# Altium schematic sheet PowerSupply.SchDoc
size A4; SheetNumber: 2; SheetTotal: 4
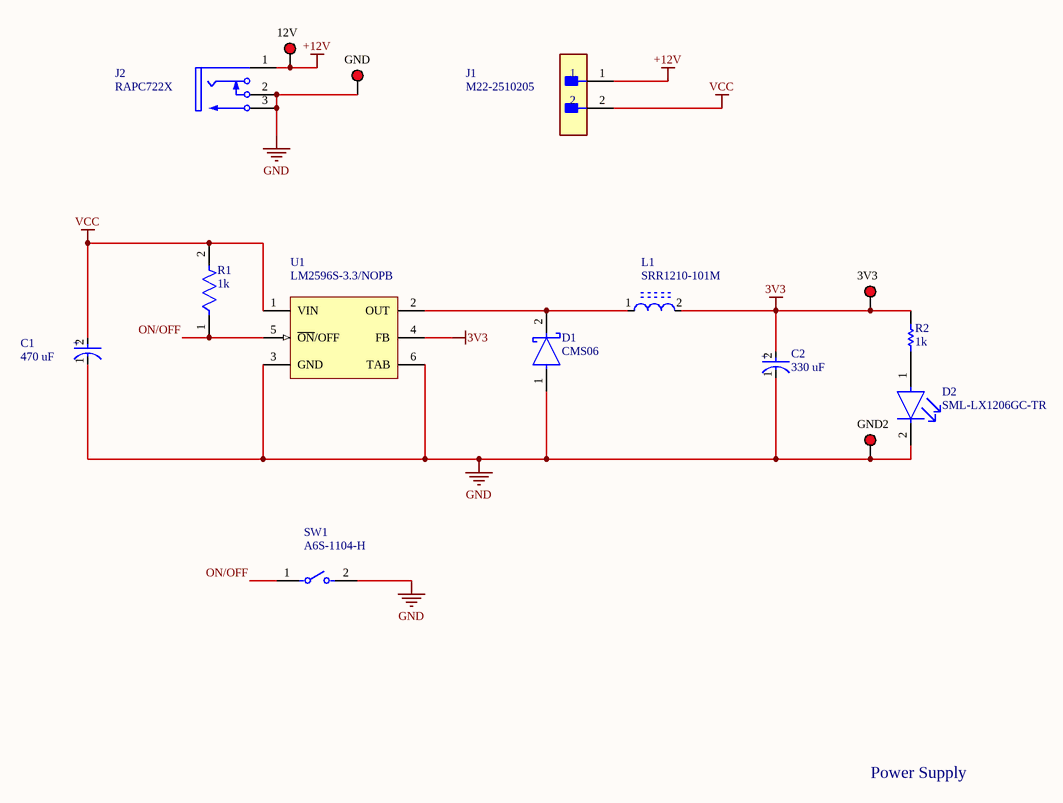
[diagram p0: PowerSupply.SchDoc]

## Parts
3V3  5010  [KSTN-5010_V]  (value not drawn)
12V  5010  [KSTN-5010_V]  (value not drawn)
C1  470 uF  [FP-FKF-MFG]
C2  330 uF  [FP-FKG-MFG]
D1  CMS06  [FP-M-FLAT-MFG]
D2  SML-LX1206GC-TR  [FP-SML-LX1206GC-TR-MFG]
GND  5010  [KSTN-5010_V]  (value not drawn)
GND2  5010  [KSTN-5010_V]  (value not drawn)
J1  M22-2510205  [FP-M22-2510205-MFG]
J2  RAPC722X  [SWITCH-RAPC712X-3_V]
L1  SRR1210-101M  [FP-SRR1210-MFG]
R1  1k  [FP-CRCW1206-e3-MFG]
R2  1k  [RESC3216X70X50ML20T25]
SW1  A6S-1104-H  [FP-A6S-1104-H-MFG]
U1  LM2596S-3.3/NOPB  [KTT0005B_M]

## Nets
3V3: 3V3.1 C2.2(A) L1.2 R2.2 U1.4(FB)
+12V: 12V.1 J1.1 J2.1
GND: C1.1(C) C2.1(C) D1.1(A) D2.2(C) GND.1 GND2.1 J2.2 J2.3 SW1.2 U1.3(GND) U1.6(TAB)
VCC: C1.2(A) J1.2 R1.2 U1.1(VIN)
ON/OFF: R1.1 SW1.1 U1.5(~{ON}/OFF)
NetD1_2: D1.2(C) L1.1 U1.2(OUT)
NetD2_1: D2.1(A) R2.1

## Notes on the sheet
- Power Supply
- (in symbol CMP-2000-06208-3) +
- (in symbol CMP-05427-002115-1) +

## Library data of the parts
3V3 12V GND GND2 = CMP-1672-00002-4: Test Point, Red, Through Hole, RoHS, Bulk; Manufacturer: Keystone; Contact Material: Bronze; Mounting Technology: Through Hole; RoHSCompliant: true; Pins: 1; Package Quantity: 100; ComponentLink2Description: Datasheet; Height: 8.12 mm; ComponentLink1URL: http://www.keyelco.com/; DatasheetVersion: Rev. F, 12/2013; Mount: Through Hole; PackageReference: 5010; Contact Plating: Silver; Packaging: Bulk; Colour: Red; REACH SVHC: No SVHC; PackageDescription: 1-Pin Through Hole Device, Dia 3.17 mm; ComponentLink2URL: http://www.keyelco.com/product-pdf.cfm?p=1319; ComponentLink1Description: Manufacturer URL
C1 = CMP-2000-06208-3: CAP ALUM 100UF 20% 50V SMD; Leakage Current: 3uA; ESR (Equivalent Series Resistance): 340mR; Material: Aluminium; Ripple Current: 350mA; Life (Hours): 2000Hour; Min Operating Temperature: -55°C; Contact Plating: Tin; REACH SVHC: No SVHC; RoHS Compliant: Yes; Width: 10mm; Radiation Hardening: No; Termination: SMD/SMT; Packaging: Tape and Reel; Max Operating Temperature: 105°C; Case/Package: Radial; Voltage Rating: 50V; Length: 10.2mm; Voltage: 50V; Package Quantity: 1; Voltage Rating (DC): 50V; Height - Seated (Max): 0.402inch; Mount: Surface Mount; Impedance: 340mR; Construction: Cylindrical; Height: 10.2mm; Lead Free: Lead Free; Dielectric Material: Aluminium; Series: FK; Tolerance: 20%; Diameter: 8mm; Ripple Current (AC): 350mA; Capacitance: 100uF; Number of Pins: 2
C2 = CMP-05427-002115-1: CAP ALUM 330UF 20% 35V SMD; ESR (Equivalent Series Resistance): 80mR; Ripple Current: 850mA; Dielectric Material: Aluminium; Lead Length: 3.5mm; Life (Hours): 2000Hour; Leakage Current: 115.5uA; Length: 10.2mm; Construction: Cylindrical; Package Quantity: 500; Termination: SMD/SMT; RoHS Compliant: Yes; Impedance: 80mR; Width: 10.3mm; Height - Seated (Max): 0.402inch; Voltage: 35V; Voltage Rating: 35V; Diameter: 10mm; Contact Plating: Tin; Number of Pins: 2; Capacitance: 330uF; Case/Package: Radial; Reach SVHC Compliant: Yes; Lead Free: Lead Free; Series: FK; Ripple Current (AC): 850mA; Tolerance: 20%; Ratings: AEC-Q200; Lead Pitch: 4.6mm; Mount: Surface Mount; Height: 10.2mm; Max Operating Temperature: 105°C; Packaging: Tape and Reel; Min Operating Temperature: -55°C; Voltage Rating (DC): 35V; Radiation Hardening: No
D1 = CMP-2000-06115-2: DIODE SCHOTTKY 30V 2A MFLAT; Forward Voltage: 370mV; Peak Non-Repetitive Surge Current: 40A; Max Reverse Leakage Current: 3mA; Element Configuration: Single; Package Quantity: 1; Max Operating Temperature: 125°C; Mount: Surface Mount; Max Repetitive Reverse Voltage (Vrrm): 30V; Forward Current: 2A; Number of Pins: 2; Min Operating Temperature: -40°C; Radiation Hardening: No; Average Rectified Current: 2A; Contact Plating: Tin; Max Reverse Voltage (DC): 30V; Peak Reverse Current: 3mA; Max Surge Current: 40A; Packaging: Tape and Reel
D2 = CMP-2000-07122-2: LED GREEN CLEAR 1206 SMD; Test Current: 20mA; Luminous Intensity: 10mcd; Forward Voltage: 2.2V; Viewing Angle: 160°; Lens Color: Colorless; Approvals: UL; Dominant Wavelength: 565nm; Current Rating: 25mA; Number of LEDs: 1; Power Rating: 65mW; Lens Style: Rectangular; Length: 3.2mm; Mount: Surface Mount; Package Quantity: 1; Forward Current: 20mA; Case/Package: 1206; Lead Free: Lead Free; Case Code (Imperial): 1206; Max Operating Temperature: 85°C; REACH SVHC: No SVHC; RoHS Compliant: Yes; Number of Pins: 2; Illumination Color: Green; Width: 1.6mm; Packaging: Tape and Reel; Wavelength: 565nm; Lens Transparency: Clear; Height: 1.1mm; Color: Green; Min Operating Temperature: -40°C; Case Code (Metric): 3216
J1 = CMP-15831-000005-1: CONN HEADER VERT 2POS 2MM; Manufacturer: Harwin; Conn Gender: Male; Current Rating: 2A; Number Of Contacts: 2; Conn Orientation: Vertical; Temperature Range Low: -40°C; Device Class L1: Connectors; ComponentLink2URL: https://cdn.harwin.com/pdfs/C018XX_M22_Series_Connectors.pdf; Temperature Range High: +105°C; Pitch: 2mm; Number Of Rows: 1; Temperature: -40°C to +105°C; Automotive: No; Device Class L3: unset; Octopart: https://octopart.com/m22-2510205-harwin-2538221; Mouser Description: Headers & Wire Housings 2 PIN SIL VERTICAL GOLD PIN HEADER; Height: 5.45mm; Category: Conn; Digikey Description: CONN HEADER VERT 2POS 2MM; Contact Material: Gold,Nickel; Lead Free: Yes; ComponentLink2Description: Datasheet; Manufacturer Part Number: M22-2510205; Device Class L2: Headers and Wire Housings; Package: 0; Footprint Url: https://cdn.harwin.com/pdfs/M22-251.pdf; RoHS: TRUE
J2 = CMP-2000-05384-1: Power Jack, 5 A, 3-Pin THD, RoHS, Bulk; Manufacturer: Switchcraft; Current Rating: 5A; Plug/Mating Plug Diameter: 2.1mmID,5.5mmOD; Gender: Male; Mating Products: S765-ND / -CONNPLUGMINIPWR2CONDWHT/RED / S760K-ND / -CONNPOWERPLUGMINI.08"BLACK / SC1052-ND / -CONNPOWERPLUGMINIBLACK; Number of Positions/Contacts: 2Conductors,2Contacts; Internal Switch(s): SingleSwitch,NormallyClosed; Shielding: Unshielded; Catalog Drawings: RAPC7(1,2)2XSide / RAPC7(1,2)2XTop; Dynamic Catalog: SwitchcraftInc; Other Names: Q2287470A / RAPC722X-ND / SC1313; Standard Package: 2,500; Termination: SolderEyelet(s); Family: Barrel-PowerConnectors; Housing Color: Black; Housing Material: Thermoplastic; RoHS Information: SwitchcraftRoHSInfo; Color: Black; Contact Material - Plating: Nickel; Mounting Type: ThroughHole,RightAngle; Manufacturer URL: http://www.switchcraft.com/; Contact Material: Brass; Datasheet Version: Rev. A, 08/2005; Connector Type: Jack; Category: Connectors,Interconnects; Datasheet URL: http://www.mouser.com/ds/2/393/rapc722x_cd-371352.pdf
L1 = CMP-07248-000065-1: FIXED IND 100UH 2.5A 135MOHM SMD; Shielding: Shielded; DC Resistance (DCR): 135mR; Core Material: Ferrite; Inductance Tolerance: 20%; Saturation Current: 2.2A; Q Factor: 16; Self Resonant Frequency: 3MHz; Test Frequency: 100kHz; Height: 10mm; Width: 0.472inch; Mount: Surface Mount; Inductance: 100uH; RMS Current (Irms): 2.5A; Packaging: Tape and Reel; Max Operating Temperature: 125°C; Military Standard: Not; DC Current: 2.5A; Max DC Current: 2.5A; Length: 12mm; RoHS Compliant: Yes; Height - Seated (Max): 0.394inch; Resistor Type: Wirewound; Current Rating: 2.5A; REACH SVHC: No SVHC; Tolerance: 20%; Series: SRR1210; Package Quantity: 1; Min Operating Temperature: -40°C; Depth: 12.5mm; Case/Package: 1210; Termination: SMD/SMT
R1 = CMP-2003-01876-2: RES Thick Film, 1.2kΩ, 1%, 0.25W, 100ppm/°C, 1206; Voltage Rating (DC): 200V; Power Rating: 250mW; Resistance: 1.2kR; Temperature Coefficient: 100ppm/°C; Features: Automotive AEC-Q200; Lead Free: Lead Free; Termination: SMD/SMT; Composition: Thick Film; Length: 3.2mm; Width: 0.063inch; Case Code (Imperial): 1206; Contact Plating: Tin; Number of Terminations: 2; Height: 0.55mm; Depth: 1.6mm; Max Operating Temperature: 155°C; Tolerance: 1%; Case/Package: 1206; Voltage Rating: 200V; Case Code (Metric): 3216; Packaging: Tape and Reel; Weight: 0.000353oz; Package Quantity: 10; Max Power Dissipation: 250mW; Min Operating Temperature: -55°C; Working Voltage: 200V; Radiation Hardening: No; Military Standard: Not
R2 = CMP-2003-04435-1: Part Number: ERA8AEB202V; Manufacturer: Panasonic
SW1 = CMP-08827-000005-1: SWITCH SLIDE DIP SPST 25MA 24V; Manufacturer: Omron Electronics Inc-EMC Div; Throw Configuration: SPST-NO; Standoff Height: 0mm; Number Of Circuits: 1; Electromechanical Life: 1000Cycles; Contact Resistance: 200mΩ; Digikey Description: SWITCH SLIDE DIP SPST 25MA 24V; ComponentLink2Description: Datasheet; Mount: Surface Mount; Manufacturer Part Number: A6S-1104-H; ComponentLink2URL: https://omronfs.omron.com/en_US/ecb/products/pdf/en-a6s.pdf; Category: Switch; Height: 3.95mm; Device Class L3: DIP Switches; Octopart: https://octopart.com/a6s-1104-h-omron-55410938; Mouser Description: DIP Switches / SIP Switches Dip Switch; Lead Free: Yes; Temperature Range Low: -20°C; Temperature Range High: +70°C; Automotive: No; Ambient Temperature Range Low: -20°C; Ambient Temperature Range High: +70°C; Voltage Rating Dc: 24V; Device Class L2: Switches; RoHS: TRUE; Package: 0; Contact Current Rating: 25mA; Device Class L1: Electromechanical; Temperature: -20°C to +70°C
U1 = CMP-0069-00275-3: SIMPLE SWITCHER® Power Converter 150 KHz 3A Step-Down Voltage Regulator, 5-pin TO-263, Pb-Free; Manufacturer: Texas Instruments; PackageTopMarking: NSUZXYTTE#*LM2596S*-3.3 P+; PowerWise: N; RoHS: Y; PackageReference: KTT0005B; PackageDescription: TO-263, Molded, .400 x .390 x .180in, 5 Lead, .067in Pitch, Surface Mount; PinCount: 5; ComponentLink1Description: Datasheet URL; Code_JEDEC: MO-169-AB; ComponentLink1URL: http://www.ti.com/general/docs/lit/getliterature.tsp?genericPartNumber=LM2596&fileType=pdf; CompType: Switcher